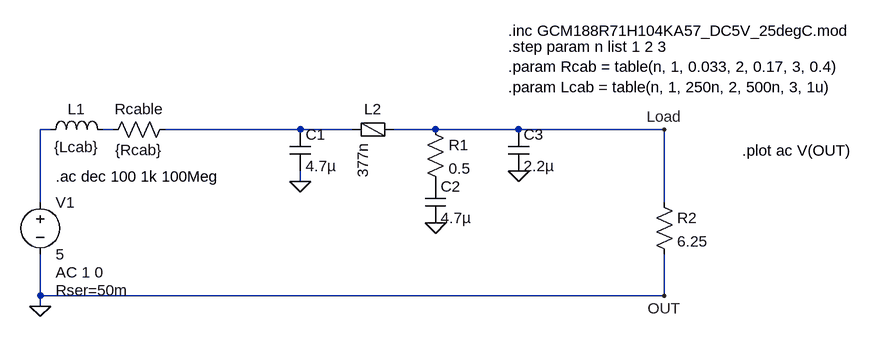
[diagram p0: schematic USB-filter.asc]
USB-filter.asc, the LTspice schematic file:
Version 4.1
SHEET 1 1356 680
WIRE 96 16 80 16
WIRE 192 16 176 16
WIRE 480 16 272 16
WIRE 560 16 480 16
WIRE 688 16 624 16
WIRE 816 16 688 16
WIRE 1040 16 816 16
WIRE 480 96 480 80
WIRE 80 128 80 16
WIRE 1040 128 1040 16
WIRE 80 272 80 208
WIRE 1040 272 1040 208
WIRE 1040 272 80 272
WIRE 80 288 80 272
FLAG 80 288 0
FLAG 480 96 0
FLAG 1040 16 Load
FLAG 1040 272 OUT
FLAG 688 160 0
FLAG 816 80 0
SYMBOL voltage 80 112 R0
WINDOW 123 24 124 Left 2
WINDOW 39 24 152 Left 2
SYMATTR Value2 AC 1 0
SYMATTR SpiceLine Rser=50m
SYMATTR InstName V1
SYMATTR Value 5
SYMBOL res 288 0 R90
WINDOW 0 0 56 VBottom 2
WINDOW 3 32 56 VTop 2
SYMATTR InstName Rcable
SYMATTR Value {Rcab}
SYMBOL ind 80 32 R270
WINDOW 0 32 56 VTop 2
WINDOW 3 5 56 VBottom 2
SYMATTR InstName L1
SYMATTR Value {Lcab}
SYMATTR SpiceLine Rser=1m
SYMBOL cap 464 16 R0
SYMATTR InstName C1
SYMATTR Value 4.7µ
SYMATTR SpiceLine V=16 Irms=0 Rser=0 Lser=0 mfg="Murata" pn="GCM31CR71C475MA37" type="X7R"
SYMBOL res 672 0 R0
SYMATTR InstName R1
SYMATTR Value 0.5
SYMBOL cap 800 16 R0
SYMATTR InstName C3
SYMATTR Value 2.2µ
SYMATTR SpiceLine V=16 Irms=0 Rser=0 Lser=0 mfg="Murata" pn="GRM188Z71C225KE43" type="X7R"
SYMBOL FerriteBead 592 16 R90
WINDOW 0 -16 0 VBottom 2
SYMATTR InstName L2
SYMATTR Value 377n
SYMATTR SpiceLine Ipk=3 Rser=0.027 Rpar=177 Cpar=847f mfg="Würth Elektronik" pn="742792023 WE-CBF 0805"
SYMBOL res 1024 112 R0
SYMATTR InstName R2
SYMATTR Value 6.25
SYMBOL cap 672 96 R0
SYMATTR InstName C2
SYMATTR Value 4.7µ
SYMATTR SpiceLine V=16 Irms=0 Rser=0 Lser=0 mfg="Murata" pn="GCM31CR71C475MA37" type="X7R"
TEXT 104 88 Left 2 !.ac dec 100 1k 100Meg
TEXT 800 -136 Left 2 !.inc GCM188R71H104KA57_DC5V_25degC.mod
TEXT 800 -112 Left 2 !.step param n list 1 2 3\n.param Rcab = table(n, 1, 0.033, 2, 0.17, 3, 0.4)\n.param Lcab = table(n, 1, 250n, 2, 500n, 3, 1u)
TEXT 1160 48 Left 2 !.plot ac V(OUT)

The netlist it stands for:
* USB-filter.asc
V1 N001 0 5 AC 1 0 Rser=50m
Rcable N003 N002 {Rcab}
L1 N001 N002 {Lcab} Rser=1m
C1 N003 0 4.7µ V=16 Irms=0 Rser=0 Lser=0 mfg="Murata" pn="GCM31CR71C475MA37" type="X7R"
R1 Load P001 0.5
C3 Load 0 2.2µ V=16 Irms=0 Rser=0 Lser=0 mfg="Murata" pn="GRM188Z71C225KE43" type="X7R"
L2 Load N003 377n Ipk=3 Rser=0.027 Rpar=177 Cpar=847f mfg="Würth Elektronik" pn="742792023 WE-CBF 0805"
R2 Load 0 6.25
C2 P001 0 4.7µ V=16 Irms=0 Rser=0 Lser=0 mfg="Murata" pn="GCM31CR71C475MA37" type="X7R"
.ac dec 100 1k 100Meg
.inc GCM188R71H104KA57_DC5V_25degC.mod
.step param n list 1 2 3
.param Rcab = table(n, 1, 0.033, 2, 0.17, 3, 0.4)
.param Lcab = table(n, 1, 250n, 2, 500n, 3, 1u)
.plot ac V(OUT)
.backanno
.end